# Altium schematic sheet Simon schematic_Updated_DR.SchDoc
size 594 x 420 mm; SheetNumber: 1; SheetTotal: 1
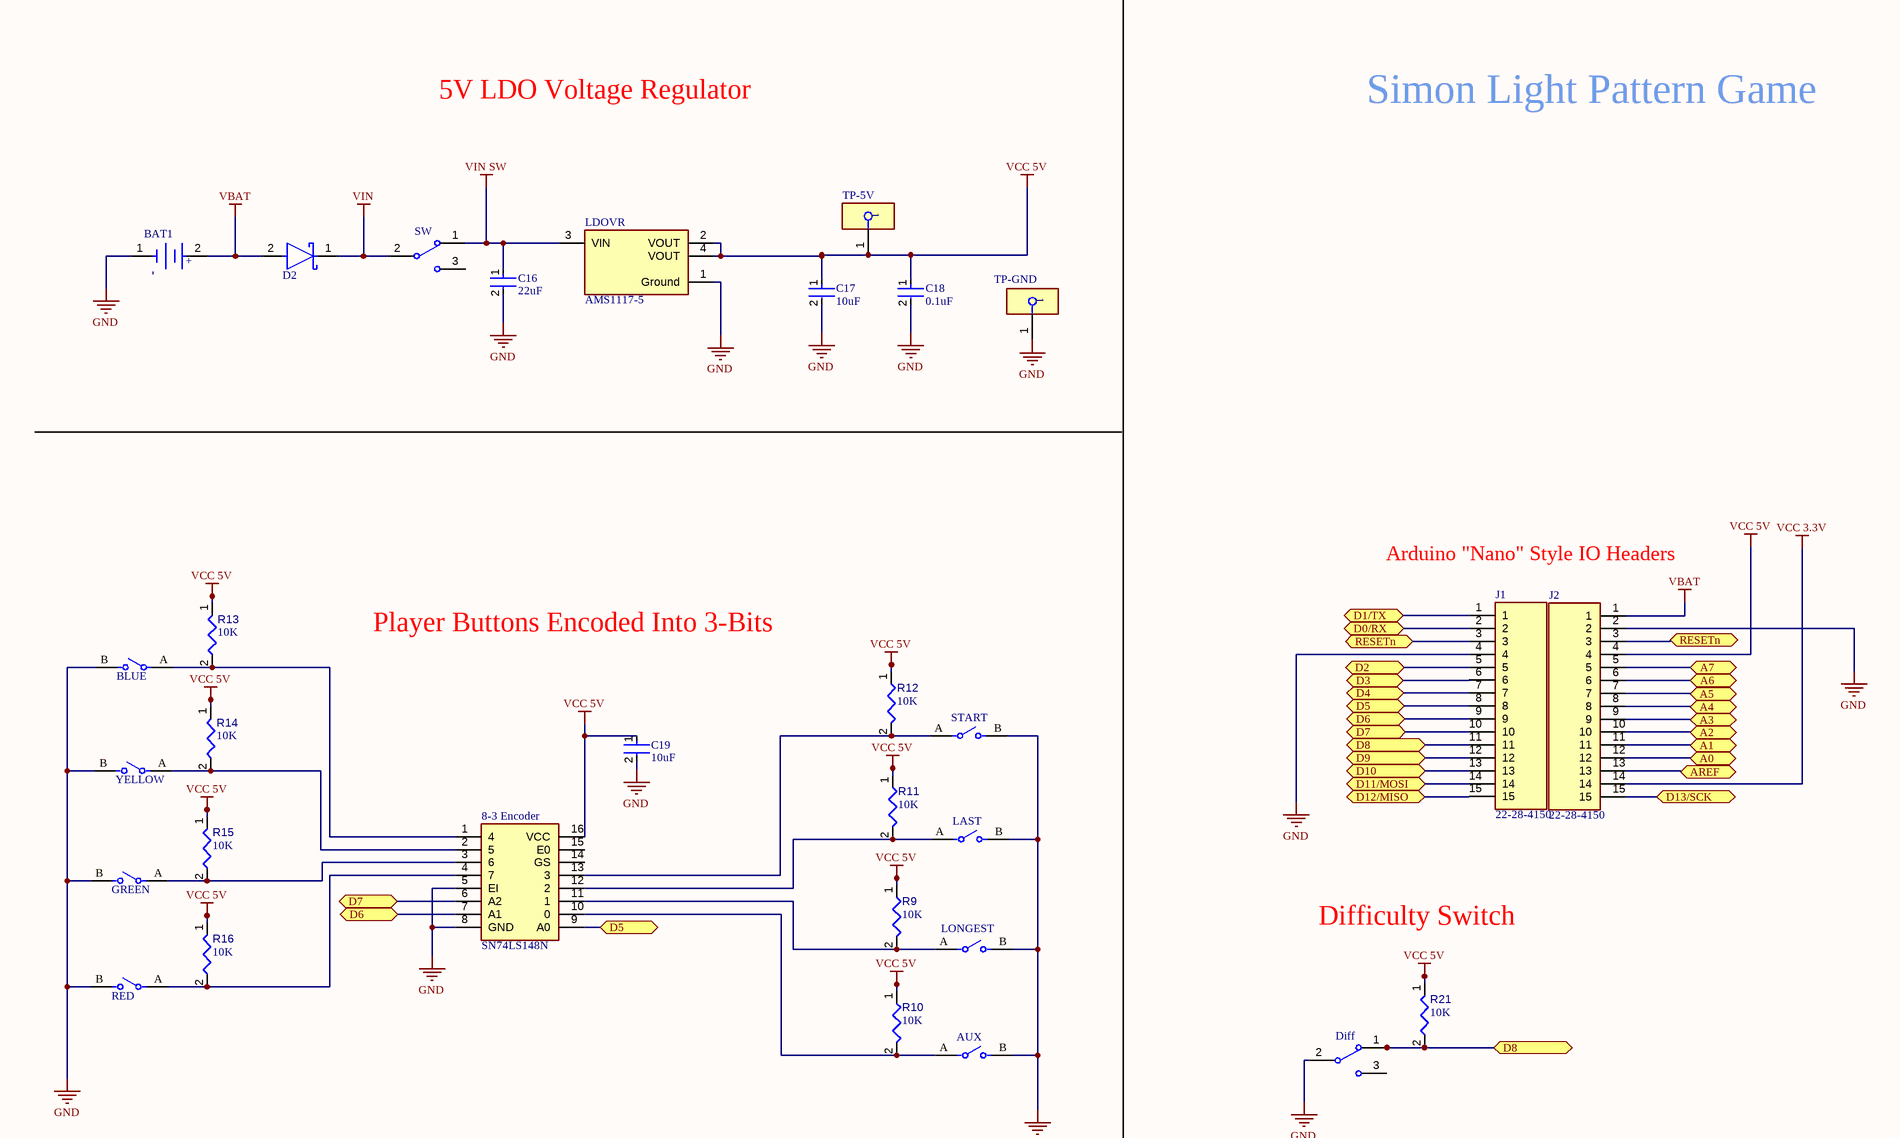
[diagram p0: Simon schematic_Updated_DR.SchDoc, top left]
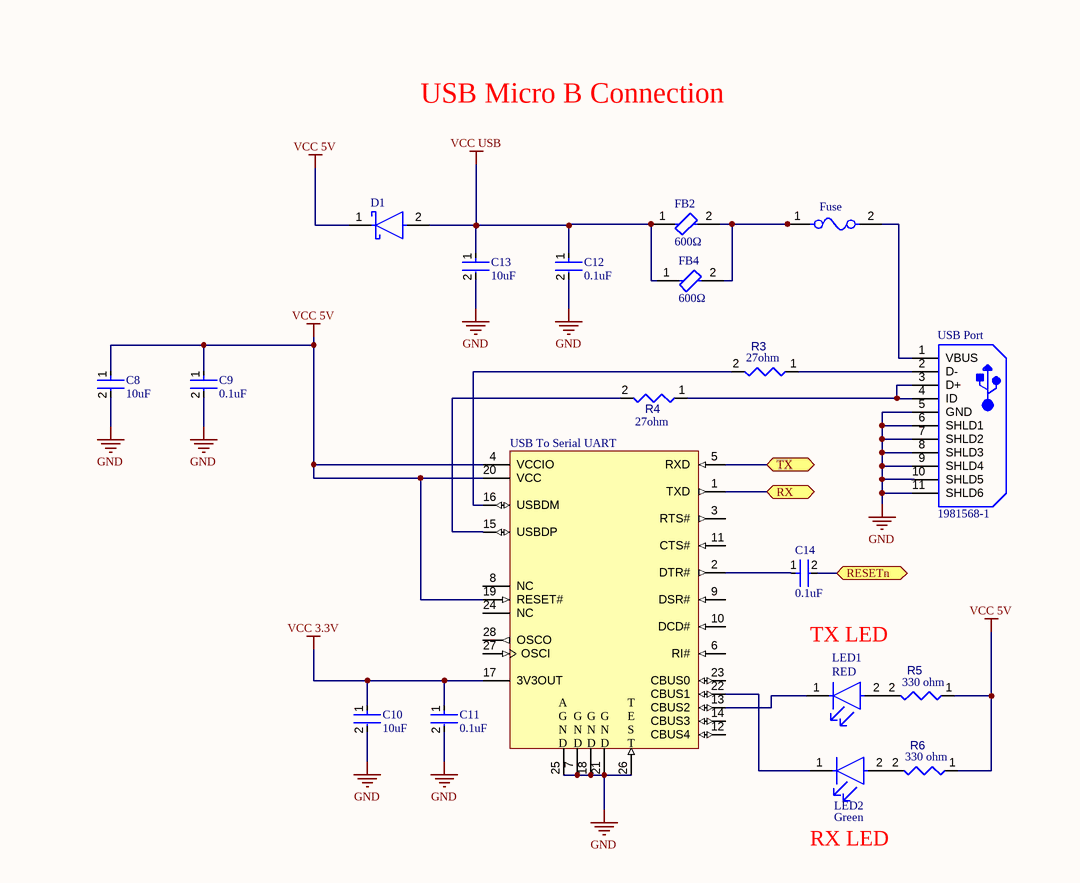
[diagram p1: Simon schematic_Updated_DR.SchDoc, top right]
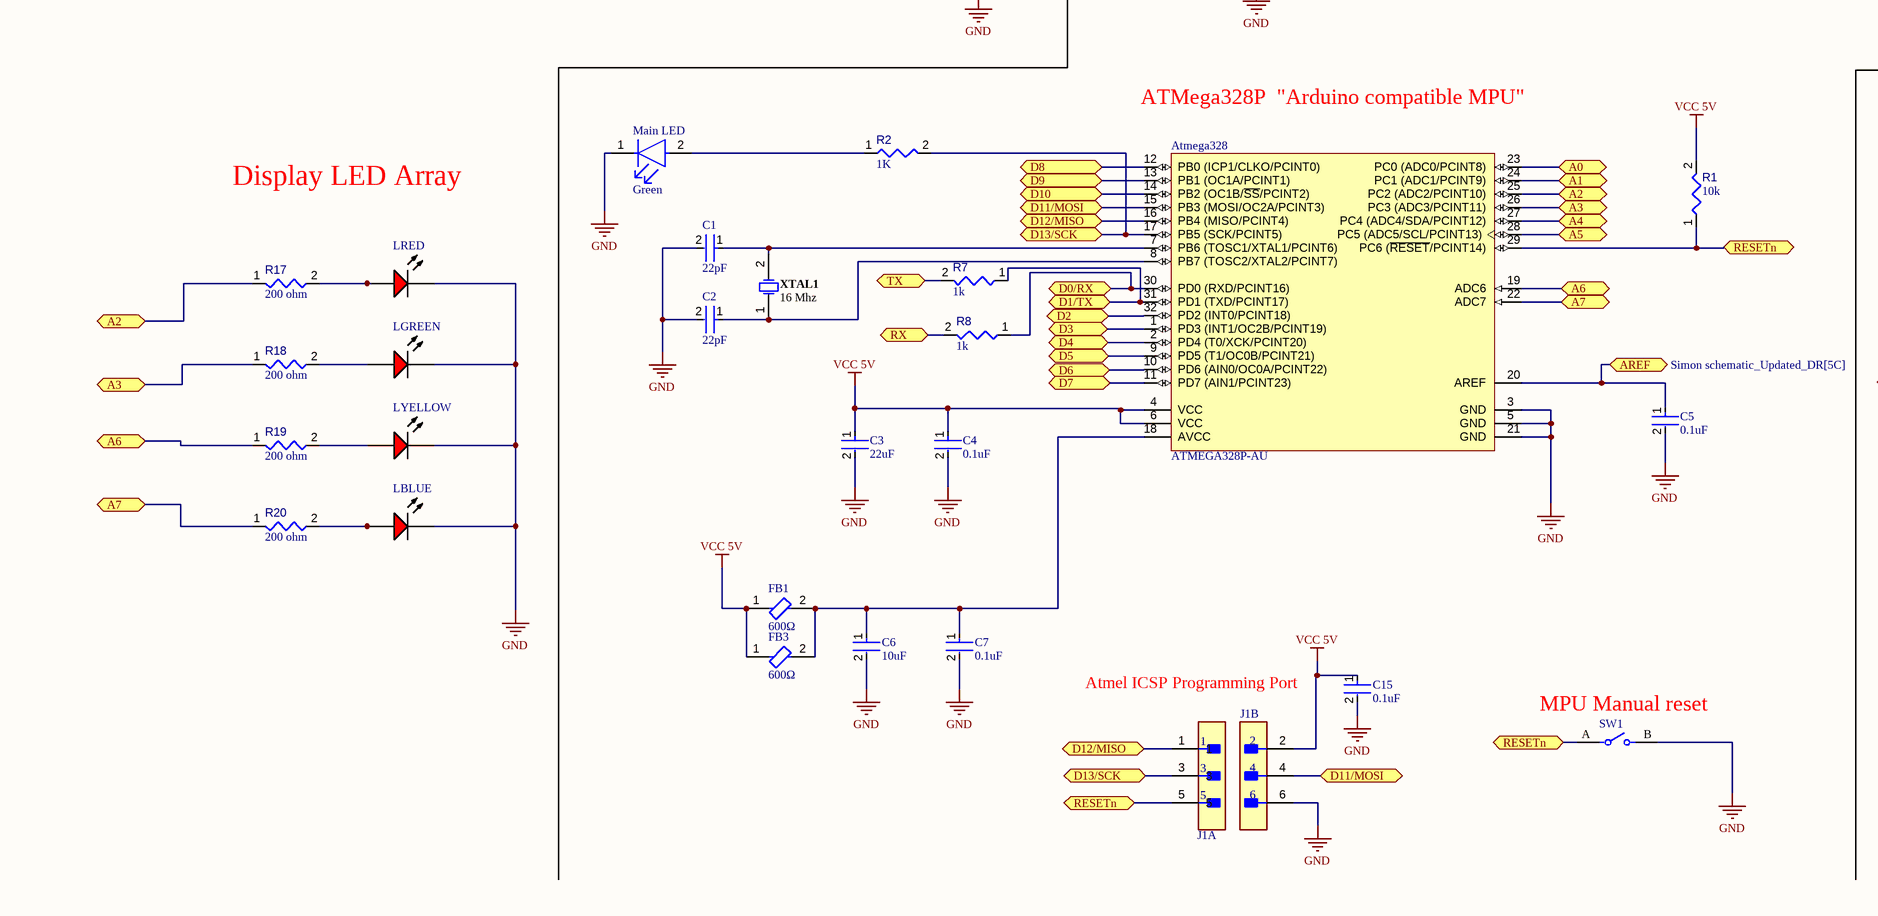
[diagram p2: Simon schematic_Updated_DR.SchDoc, bottom left]
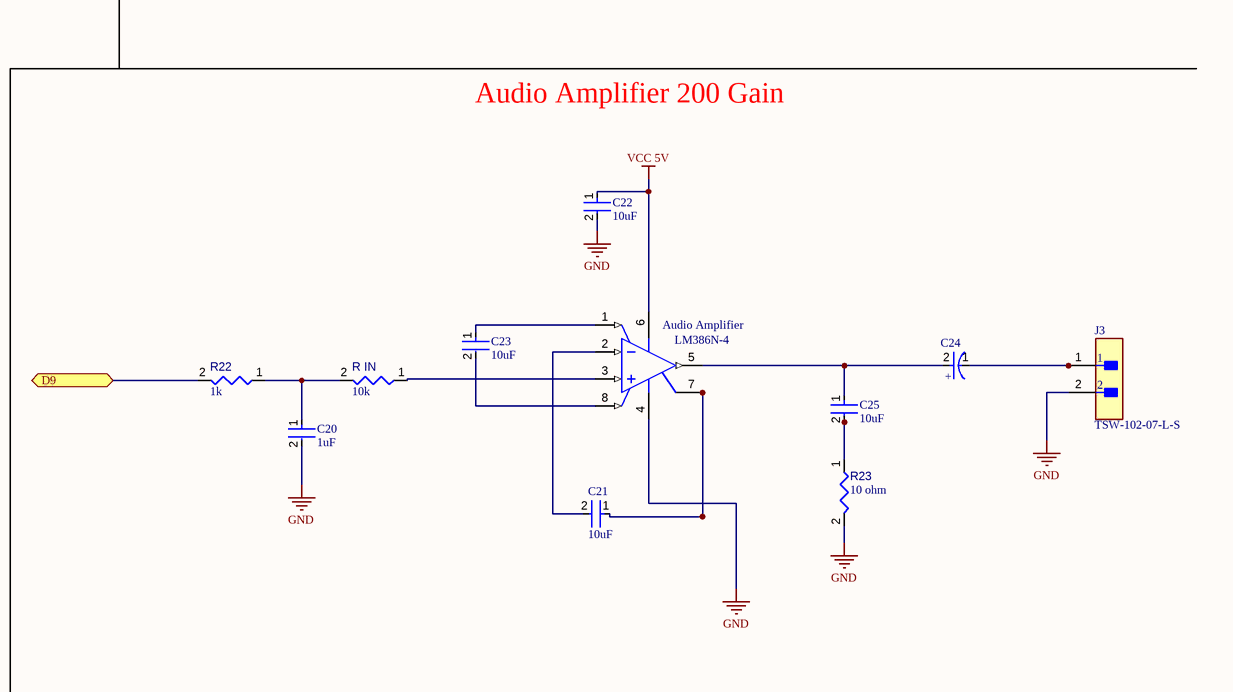
[diagram p3: Simon schematic_Updated_DR.SchDoc, bottom right]

## Parts
(Parts that share a designator on the sheet are numbered #1, #2 ... from top to bottom, then left to right.)
8-3_Encoder  SN74LS148N  [DIP794W53P254L1930H508Q16N]
Atmega328  ATMEGA328P-AU  [ATML-32A_M]
Audio_Amplifier  LM386N-4  [TI-P8]
AUX  EVQ-21405R  [FP-EVQ-21405R-MFG]  (value not drawn)
BAT1  BH9VPC  [FP-BH9VPC-MFG]  (value not drawn)
BLUE  EVQ-21405R  [FP-EVQ-21405R-MFG]  (value not drawn)
C1  22pF  [FP-0805-L_2_01_0_2-W_1_25-IPC_C]
C2  22pF  [FP-0805-L_2_01_0_2-W_1_25-IPC_C]
C3  22uF  [FP-0805-L_2_01_0_2-W_1_25-IPC_C]
C4  0.1uF  [FP-0805-L_2_01_0_2-W_1_25-IPC_C]
C5  0.1uF  [FP-0805-L_2_01_0_2-W_1_25-IPC_C]
C6  10uF  [FP-0805-L_2_01_0_2-W_1_25-IPC_C]
C7  0.1uF  [FP-0805-L_2_01_0_2-W_1_25-IPC_C]
C8  10uF  [FP-0805-L_2_01_0_2-W_1_25-IPC_C]
C9  0.1uF  [FP-0805-L_2_01_0_2-W_1_25-IPC_C]
C10  10uF  [FP-0805-L_2_01_0_2-W_1_25-IPC_C]
C11  0.1uF  [FP-0805-L_2_01_0_2-W_1_25-IPC_C]
C12  0.1uF  [FP-0805-L_2_01_0_2-W_1_25-IPC_C]
C13  10uF  [FP-0805-L_2_01_0_2-W_1_25-IPC_C]
C14  0.1uF  [FP-0805-L_2_01_0_2-W_1_25-IPC_C]
C15  0.1uF  [FP-0805-L_2_01_0_2-W_1_25-IPC_C]
C16  22uF  [FP-0805-L_2_01_0_2-W_1_25-IPC_C]
C17  10uF  [FP-0805-L_2_01_0_2-W_1_25-IPC_C]
C18  0.1uF  [FP-0805-L_2_01_0_2-W_1_25-IPC_C]
C19  10uF  [FP-0805-L_2_01_0_2-W_1_25-IPC_C]
C20  1uF  [FP-0805-L_2_01_0_2-W_1_25-IPC_C]
C21  10uF  [FP-0805-L_2_01_0_2-W_1_25-IPC_C]
C22  10uF  [FP-0805-L_2_01_0_2-W_1_25-IPC_C]
C23  10uF  [FP-0805-L_2_01_0_2-W_1_25-IPC_C]
C24  T491B106K020AT  [FP-T491B106K020AT-MFG]  (value not drawn)
C25  10uF  [FP-0805-L_2_01_0_2-W_1_25-IPC_C]
D1  SS34-E3/9AT  [FP-SMC-MFG]  (value not drawn)
D2  SS34-E3/9AT  [FP-SMC-MFG]  (value not drawn)
Diff  EG1218  [ESWI-EG1218_V]  (value not drawn)
FB1  600Ω  [FP-BLM21-0_2-t0_85-e0_5-MFG]
FB2  600Ω  [FP-BLM21-0_2-t0_85-e0_5-MFG]
FB3  600Ω  [FP-BLM21-0_2-t0_85-e0_5-MFG]
FB4  600Ω  [FP-BLM21-0_2-t0_85-e0_5-MFG]
Fuse  MF-NSMF110-2  [FP-MF-NSMF110-2-MFG]  (value not drawn)
GREEN  EVQ-21405R  [FP-EVQ-21405R-MFG]  (value not drawn)
J1#1  22-28-4150  [HDRV15W66P0X254_1X15_3810X249X838P]
J1#2  M20-9980346  [FP-M20-9980346-MFG]  (value not drawn)  (parts A,B of 2)
J2  22-28-4150  [HDRV15W66P0X254_1X15_3810X249X838P]
J3  TSW-102-07-L-S  [FP-TSW-102-07-L-S-MFG]
LAST  EVQ-21405R  [FP-EVQ-21405R-MFG]  (value not drawn)
LBLUE  C503B-RAN-CY0B0AA2  [CREE-C503B-RAN]  (value not drawn)
LDOVR  AMS1117-5  [FP-AMS1117-IPC_C]
LED1  RED  [FP-APHCM2012SYCK-F01-MFG]
LED2  Green  [FP-APHCM2012SYCK-F01-MFG]
LGREEN  C503B-RAN-CY0B0AA2  [CREE-C503B-RAN]  (value not drawn)
LONGEST  EVQ-21405R  [FP-EVQ-21405R-MFG]  (value not drawn)
LRED  C503B-RAN-CY0B0AA2  [CREE-C503B-RAN]  (value not drawn)
LYELLOW  C503B-RAN-CY0B0AA2  [CREE-C503B-RAN]  (value not drawn)
Main_LED  Green  [FP-APHCM2012SYCK-F01-MFG]
R1  10K  [RESC0805(2012)_L]
R2  1K  [RESC0805(2012)_L]
R3  27ohm  [RESC0805(2012)_L]
R4  value 27ohm  [RESC0805(2012)_L]  (hidden comment: 10K)
R5  value 330 ohm  [RESC0805(2012)_L]  (hidden comment: 330ohm)
R6  value 330 ohm  [RESC0805(2012)_L]  (hidden comment: 27ohm)
R7  1K  [RESC0805(2012)_L]
R8  value 1k  [RESC0805(2012)_L]  (hidden comment: 10K)
R9  value 10K  [RESC0805(2012)_L]  (hidden comment: 10K ohm)
R10  value 10K  [RESC0805(2012)_L]  (hidden comment: 10K ohm)
R11  value 10K  [RESC0805(2012)_L]  (hidden comment: 10K ohm)
R12  value 10K  [RESC0805(2012)_L]  (hidden comment: 10K ohm)
R13  value 10K  [RESC0805(2012)_L]  (hidden comment: 10K ohm)
R14  value 10K  [RESC0805(2012)_L]  (hidden comment: 10K ohm)
R15  value 10K  [RESC0805(2012)_L]  (hidden comment: 10K ohm)
R16  value 10K  [RESC0805(2012)_L]  (hidden comment: 10K ohm)
R17  value 200 ohm  [RESC0805(2012)_L]  (hidden comment: 10K ohm)
R18  value 200 ohm  [RESC0805(2012)_L]  (hidden comment: 10K ohm)
R19  value 200 ohm  [RESC0805(2012)_L]  (hidden comment: 10K ohm)
R20  value 200 ohm  [RESC0805(2012)_L]  (hidden comment: 10K ohm)
R21  value 10K  [RESC0805(2012)_L]  (hidden comment: 10K ohm)
R22  1K  [RESC0805(2012)_L]
R23  value 10 ohm  [RESC0805(2012)_L]  (hidden comment: 10)
R_IN  10K  [RESC0805(2012)_L]
RED  EVQ-21405R  [FP-EVQ-21405R-MFG]  (value not drawn)
START  EVQ-21405R  [FP-EVQ-21405R-MFG]  (value not drawn)
SW  EG1218  [ESWI-EG1218_V]  (value not drawn)
SW1  EVQ-21405R  [FP-EVQ-21405R-MFG]  (value not drawn)
TP-5V  S2761-46R  [FP-S2761-46R-MFG]  (value not drawn)
TP-GND  S2761-46R  [FP-S2761-46R-MFG]  (value not drawn)
USB_Port  1981568-1  [TECO-1981568-5_V]
USB_To_Serial_UART  FT232RL-REEL  [FTDI-SSOP-28_M]  (value not drawn)
XTAL1  16 Mhz  [JPY-49S-18PF]
YELLOW  EVQ-21405R  [FP-EVQ-21405R-MFG]  (value not drawn)

## Ports
A0 (bidir, see Simon schematic_Updated_DR[5C]), A0 (bidir, see Simon schematic_Updated_DR[5E]), A1 (bidir, see Simon schematic_Updated_DR[5C]), A1 (bidir, see Simon schematic_Updated_DR[5E]), A2 (bidir, see Simon schematic_Updated_DR[1E], Simon schematic_Updated_DR[5C]), A2 (bidir, see Simon schematic_Updated_DR[1E], Simon schematic_Updated_DR[5E]), A2 (bidir, see Simon schematic_Updated_DR[5C], Simon schematic_Updated_DR[5E]), A3 (bidir, see Simon schematic_Updated_DR[1E], Simon schematic_Updated_DR[5C]), A3 (bidir, see Simon schematic_Updated_DR[1E], Simon schematic_Updated_DR[5E]), A3 (bidir, see Simon schematic_Updated_DR[5C], Simon schematic_Updated_DR[5E]), A4 (bidir, see Simon schematic_Updated_DR[5C]), A4 (bidir, see Simon schematic_Updated_DR[5E]), A5 (bidir, see Simon schematic_Updated_DR[5C]), A5 (bidir, see Simon schematic_Updated_DR[5E]), A6 (bidir, see Simon schematic_Updated_DR[1E], Simon schematic_Updated_DR[5C]), A6 (bidir, see Simon schematic_Updated_DR[1E], Simon schematic_Updated_DR[5E]), A6 (bidir, see Simon schematic_Updated_DR[5C], Simon schematic_Updated_DR[5E]), A7 (bidir, see Simon schematic_Updated_DR[1E], Simon schematic_Updated_DR[5C]), A7 (bidir, see Simon schematic_Updated_DR[1E], Simon schematic_Updated_DR[5E]), A7 (bidir, see Simon schematic_Updated_DR[5C], Simon schematic_Updated_DR[5E]), AREF (bidir, see Simon schematic_Updated_DR[5C]), AREF (bidir, see Simon schematic_Updated_DR[5E]), D0/RX (bidir, see Simon schematic_Updated_DR[3E]), D0/RX (bidir, see Simon schematic_Updated_DR[4C]), D1/TX (bidir, see Simon schematic_Updated_DR[3E]), D1/TX (bidir, see Simon schematic_Updated_DR[4C]), D2 (bidir, see Simon schematic_Updated_DR[3E]), D2 (bidir, see Simon schematic_Updated_DR[4C]), D3 (bidir, see Simon schematic_Updated_DR[3E]), D3 (bidir, see Simon schematic_Updated_DR[4C]), D4 (bidir, see Simon schematic_Updated_DR[3E]), D4 (bidir, see Simon schematic_Updated_DR[4C]), D5 (bidir, see Simon schematic_Updated_DR[2D], Simon schematic_Updated_DR[3E]), D5 (bidir, see Simon schematic_Updated_DR[2D], Simon schematic_Updated_DR[4C]), D5 (bidir, see Simon schematic_Updated_DR[3E], Simon schematic_Updated_DR[4C]), D6 (bidir, see Simon schematic_Updated_DR[1C], Simon schematic_Updated_DR[3E]), D6 (bidir, see Simon schematic_Updated_DR[1C], Simon schematic_Updated_DR[4C]), D6 (bidir, see Simon schematic_Updated_DR[3E], Simon schematic_Updated_DR[4C]), D7 (bidir, see Simon schematic_Updated_DR[1C], Simon schematic_Updated_DR[3E]), D7 (bidir, see Simon schematic_Updated_DR[1C], Simon schematic_Updated_DR[4C]), D7 (bidir, see Simon schematic_Updated_DR[3E], Simon schematic_Updated_DR[4C]), D8 (bidir, see Simon schematic_Updated_DR[3E], Simon schematic_Updated_DR[4C]), D8 (bidir, see Simon schematic_Updated_DR[3E], Simon schematic_Updated_DR[4D]), D8 (bidir, see Simon schematic_Updated_DR[4C], Simon schematic_Updated_DR[4D]), D9 (bidir, see Simon schematic_Updated_DR[3E], Simon schematic_Updated_DR[4C]), D9 (bidir, see Simon schematic_Updated_DR[3E], Simon schematic_Updated_DR[5E]), D9 (bidir, see Simon schematic_Updated_DR[4C], Simon schematic_Updated_DR[5E]), D10 (bidir, see Simon schematic_Updated_DR[3E]), D10 (bidir, see Simon schematic_Updated_DR[4C]), D11/MOSI (bidir, see Simon schematic_Updated_DR[3E], Simon schematic_Updated_DR[4C]), D11/MOSI (bidir, see Simon schematic_Updated_DR[3E], Simon schematic_Updated_DR[4F]), D11/MOSI (bidir, see Simon schematic_Updated_DR[4C], Simon schematic_Updated_DR[4F]), D12/MISO (bidir, see Simon schematic_Updated_DR[3E], Simon schematic_Updated_DR[3F]), D12/MISO (bidir, see Simon schematic_Updated_DR[3E], Simon schematic_Updated_DR[4C]), D12/MISO (bidir, see Simon schematic_Updated_DR[3F], Simon schematic_Updated_DR[4C]), D13/SCK (bidir, see Simon schematic_Updated_DR[3E], Simon schematic_Updated_DR[3F]), D13/SCK (bidir, see Simon schematic_Updated_DR[3E], Simon schematic_Updated_DR[5C]), D13/SCK (bidir, see Simon schematic_Updated_DR[3F], Simon schematic_Updated_DR[5C]), RESETn (bidir, see Simon schematic_Updated_DR[3F], Simon schematic_Updated_DR[4C], Simon schematic_Updated_DR[5C], Simon schematic_Updated_DR[5E], Simon schematic_Updated_DR[5F]), RESETn (bidir, see Simon schematic_Updated_DR[3F], Simon schematic_Updated_DR[4C], Simon schematic_Updated_DR[5C], Simon schematic_Updated_DR[5E], Simon schematic_Updated_DR[8C]), RESETn (bidir, see Simon schematic_Updated_DR[3F], Simon schematic_Updated_DR[4C], Simon schematic_Updated_DR[5C], Simon schematic_Updated_DR[5F], Simon schematic_Updated_DR[8C]), RESETn (bidir, see Simon schematic_Updated_DR[3F], Simon schematic_Updated_DR[4C], Simon schematic_Updated_DR[5E], Simon schematic_Updated_DR[5F], Simon schematic_Updated_DR[8C]), RESETn (bidir, see Simon schematic_Updated_DR[3F], Simon schematic_Updated_DR[5C], Simon schematic_Updated_DR[5E], Simon schematic_Updated_DR[5F], Simon schematic_Updated_DR[8C]), RESETn (bidir, see Simon schematic_Updated_DR[4C], Simon schematic_Updated_DR[5C], Simon schematic_Updated_DR[5E], Simon schematic_Updated_DR[5F], Simon schematic_Updated_DR[8C]), RX (bidir, see Simon schematic_Updated_DR[3E]), RX (bidir, see Simon schematic_Updated_DR[8C]), TX (bidir, see Simon schematic_Updated_DR[3E]), TX (bidir, see Simon schematic_Updated_DR[8C])

## Nets
GND: 8-3_Encoder.5(EI) 8-3_Encoder.8(GND) Atmega328.3(GND) Atmega328.5(GND) Atmega328.21(GND) Audio_Amplifier.4(GND) AUX.B BAT1.1(C) BLUE.B C1.2 C2.2 C3.2 C4.2 C5.2 C6.2 C7.2 C8.2 C9.2 C10.2 C11.2 C12.2 C13.2 C15.2 C16.2 C17.2 C18.2 C19.2 C20.2 C22.2 Diff.2(COM) GREEN.B J1#1.4 J1#2.6 J2.2 J3.2 LAST.B LBLUE.2(K) LDOVR.1(Ground) LGREEN.2(K) LONGEST.B LRED.2(K) LYELLOW.2(K) Main_LED.1(C) R23.2 RED.B START.B SW1.B TP-GND.1 USB_Port.5(GND) USB_Port.6(SHLD1) USB_Port.7(SHLD2) USB_Port.8(SHLD3) USB_Port.9(SHLD4) USB_Port.10(SHLD5) USB_Port.11(SHLD6) USB_To_Serial_UART.7(GND) USB_To_Serial_UART.18(GND) USB_To_Serial_UART.21(GND) USB_To_Serial_UART.25(AGND) USB_To_Serial_UART.26(TEST) YELLOW.B
VBAT: BAT1.2(A) D2.2(A) J2.1
VCC 3.3V: C10.1 C11.1 J2.14 USB_To_Serial_UART.17(3V3OUT)
VCC 5V: 8-3_Encoder.16(VCC) Atmega328.4(VCC) Atmega328.6(VCC) Audio_Amplifier.6(VS) C3.1 C4.1 C8.1 C9.1 C15.1 C17.1 C18.1 C19.1 C22.1 D1.1(C) FB1.1 FB3.1 J1#2.2 J2.4 LDOVR.2(VOUT) LDOVR.4(VOUT) R1.2 R5.1 R6.1 R9.1 R10.1 R11.1 R12.1 R13.1 R14.1 R15.1 R16.1 R21.1 TP-5V.1 USB_To_Serial_UART.4(VCCIO) USB_To_Serial_UART.19(RESET#) USB_To_Serial_UART.20(VCC)
VCC USB: C12.1 C13.1 D1.2(A) FB2.1 FB4.1
VIN: D2.1(C) SW.2(COM)
VIN SW: C16.1 LDOVR.3(VIN) SW.1
A0: Atmega328.23(PC0_(ADC0/PCINT8)) J2.12 ; port A0
A1: Atmega328.24(PC1_(ADC1/PCINT9)) J2.11 ; port A1
A2: Atmega328.25(PC2_(ADC2/PCINT10)) J2.10 R17.1 ; port A2
A3: Atmega328.26(PC3_(ADC3/PCINT11)) J2.9 R18.1 ; port A3
A4: Atmega328.27(PC4_(ADC4/SDA/PCINT12)) J2.8 ; port A4
A5: Atmega328.28(PC5_(ADC5/SCL/PCINT13)) J2.7 ; port A5
A6: Atmega328.19(ADC6) J2.6 R19.1 ; port A6
A7: Atmega328.22(ADC7) J2.5 R20.1 ; port A7
AREF: Atmega328.20(AREF) C5.1 J2.13 ; port AREF
D0/RX: Atmega328.30(PD0_(RXD/PCINT16)) J1#1.2 R8.1 ; port D0/RX
D1/TX: Atmega328.31(PD1_(TXD/PCINT17)) J1#1.1 R7.1 ; port D1/TX
D2: Atmega328.32(PD2_(INT0/PCINT18)) J1#1.5 ; port D2
D3: Atmega328.1(PD3_(INT1/OC2B/PCINT19)) J1#1.6 ; port D3
D4: Atmega328.2(PD4_(T0/XCK/PCINT20)) J1#1.7 ; port D4
D5: 8-3_Encoder.9(A0) Atmega328.9(PD5_(T1/OC0B/PCINT21)) J1#1.8 ; port D5
D6: 8-3_Encoder.7(A1) Atmega328.10(PD6_(AIN0/OC0A/PCINT22)) J1#1.9 ; port D6
D7: 8-3_Encoder.6(A2) Atmega328.11(PD7_(AIN1/PCINT23)) J1#1.10 ; port D7
D8: Atmega328.12(PB0_(ICP1/CLKO/PCINT0)) Diff.1 J1#1.11 R21.2 ; port D8
D9: Atmega328.13(PB1_(OC1A/PCINT1)) J1#1.12 R22.2 ; port D9
D10: Atmega328.14(PB2_(OC1B/~{SS}/PCINT2)) J1#1.13 ; port D10
D11/MOSI: Atmega328.15(PB3_(MOSI/OC2A/PCINT3)) J1#1.14 J1#2.4 ; port D11/MOSI
D12/MISO: Atmega328.16(PB4_(MISO/PCINT4)) J1#1.15 J1#2.1 ; port D12/MISO
D13/SCK: Atmega328.17(PB5_(SCK/PCINT5)) J1#2.3 J2.15 R2.2 ; port D13/SCK
RESETn: Atmega328.29(PC6_(~{RESET}/PCINT14)) C14.2 J1#1.3 J1#2.5 J2.3 R1.1 SW1.A ; port RESETn
RX: R8.2 USB_To_Serial_UART.1(TXD) ; port RX
TX: R7.2 USB_To_Serial_UART.5(RXD) ; port TX
Net8-3_Encoder_1: 8-3_Encoder.1(4) BLUE.A R13.2
Net8-3_Encoder_2: 8-3_Encoder.2(5) R14.2 YELLOW.A
Net8-3_Encoder_3: 8-3_Encoder.3(6) GREEN.A R15.2
Net8-3_Encoder_4: 8-3_Encoder.4(7) R16.2 RED.A
Net8-3_Encoder_10: 8-3_Encoder.10(0) AUX.A R10.2
Net8-3_Encoder_11: 8-3_Encoder.11(1) LONGEST.A R9.2
Net8-3_Encoder_12: 8-3_Encoder.12(2) LAST.A R11.2
Net8-3_Encoder_13: 8-3_Encoder.13(3) R12.2 START.A
NetAtmega328_7: Atmega328.7(PB6_(TOSC1/XTAL1/PCINT6)) C1.1 XTAL1.2
NetAtmega328_8: Atmega328.8(PB7_(TOSC2/XTAL2/PCINT7)) C2.1 XTAL1.1
NetAtmega328_18: Atmega328.18(AVCC) C6.1 C7.1 FB1.2 FB3.2
NetAudio_Amplifier_1: Audio_Amplifier.1(GAIN) C23.1
NetAudio_Amplifier_2: Audio_Amplifier.2(IN-) C21.2
NetAudio_Amplifier_3: Audio_Amplifier.3(IN+) R_IN.1
NetAudio_Amplifier_5: Audio_Amplifier.5(VOUT) C24.2(A) C25.1
NetAudio_Amplifier_7: Audio_Amplifier.7(BYPASS) C21.1
NetAudio_Amplifier_8: Audio_Amplifier.8(GAIN) C23.2
NetC14_1: C14.1 USB_To_Serial_UART.2(DTR#)
NetC20_1: C20.1 R22.1 R_IN.2
NetC24_1: C24.1(C) J3.1
NetC25_2: C25.2 R23.1
NetFB2_2: FB2.2 FB4.2 Fuse.1
NetFuse_2: Fuse.2 USB_Port.1(VBUS)
NetLBLUE_1: LBLUE.1(A) R20.2
NetLED1_1: LED1.1(C) USB_To_Serial_UART.13(CBUS2)
NetLED1_2: LED1.2(A) R5.2
NetLED2_1: LED2.1(C) USB_To_Serial_UART.22(CBUS1)
NetLED2_2: LED2.2(A) R6.2
NetLGREEN_1: LGREEN.1(A) R18.2
NetLRED_1: LRED.1(A) R17.2
NetLYELLOW_1: LYELLOW.1(A) R19.2
NetMain_LED_2: Main_LED.2(A) R2.1
NetR3_1: R3.1 USB_Port.2(D-)
NetR3_2: R3.2 USB_To_Serial_UART.16(USBDM)
NetR4_1: R4.1 USB_Port.3(D+) USB_Port.4(ID)
NetR4_2: R4.2 USB_To_Serial_UART.15(USBDP)

Not connected (* = marked no-connect by the designer): 8-3_Encoder 14(GS) 15(E0); Diff 3; SW 3; USB_To_Serial_UART 3(RTS#) 6(RI#) 8(NC) 9(DSR#) 10(DCD#) 11(CTS#) 12(CBUS4) 14(CBUS3) 23(CBUS0) 24(NC) 27(OSCI) 28(OSCO)

## Notes on the sheet
- 5V LDO Voltage Regulator
- Simon Light Pattern Game
- USB Micro B Connection
- Arduino "Nano" Style IO Headers
- Player Buttons Encoded Into 3-Bits
- TX LED
- Difficulty Switch
- RX LED
- ATMega328P  "Arduino compatible MPU"
- Audio Amplifier 200 Gain
- Display LED Array
- Atmel ICSP Programming Port
- (near SW1) MPU Manual reset
- DWG NO:
- REV:
- THIS DOCUMENT AND THE DATA DISCLOSED HEREIN OR
- HEREWITH IS THE PROPERTY OF ALTIUM LIMITED AND MAY
- BE FREELY DISTRIBUTED IN WHOLE. NO RIGHTS ARE
- RESERVED OR EXPRESS OR IMPLIED WARANTEE GIVEN.
- REVISION
- DESCRIPTION
- DATE
- APPROVED
- ENG:
- APPROVALS
- PROJECT
- DSN:
- CHK:
- REFERENCE DOCUMENTS
- PROJECT REVISION:
- TITLE
- DOCUMENT REVISION:
- DESIGN ITEM:
- BOM:
- FAB DWG:
- PCB DWG:
- ASSY DWG:
- SCALE:
- A2
- SIZE
- CAGE CODE
- FILE NAME
- DWG NO.
- SHEET
- OF
- REV
- (in symbol CMP-015-00000-2) A / G / N / D; G / N / D; T / E / S / T
- (in symbol CMP-2000-07191-2) +
- (in symbol CMP-136216-000001-1) +; -

## Library data of the parts
8-3_Encoder = SN74LS148N: 8-Line to 3-Line Priority Encoder; Manufacturer_Name: Texas Instruments; Geometry.Height: 5.08mm; Manufacturer_Part_Number: SN74LS148N; Mouser Part Number: 595-SN74LS148N; Mouser Price/Stock: https://www.mouser.co.uk/ProductDetail/Texas-Instruments/SN74LS148N?qs=dQtLEVC3WoZem4LPSmNMPw%3D%3D; Arrow Part Number: SN74LS148N; Arrow Price/Stock: https://www.arrow.com/en/products/sn74ls148n/texas-instruments?region=nac; Datasheet Link: https://datasheet.datasheetarchive.com/originals/distributors/Datasheets-SFU2/DSASFU100029941.pdf
Atmega328 = CMP-020-00003-3: 8-Bit Microcontroller with 32 KBytes In-System Programmable Flash, 23 I/Os, -40 to 85 degC, 32-Pin TQFP (32A), RoHS, Tray; Manufacturer: Atmel; PWM Channels: 6; Frequency: 20MHz; RAM Size: 2KB; ADC Channels: 8; Max Supply Voltage: 5.5V; Density: 32KB; USB Channels: 0; I/Os: 23; Min Supply Voltage: 1.8V; Interface: USART; Package Reference: 32A; Package Description: 32-Pin Thin Profile Plastic Quad Flat Package, Body 7 x 7 mm, Pitch 0.8 mm; Max Operating Temperature: 85°C; Mounting Technology: SM; Datasheet URL: http://www.atmel.com/images/Atmel-8271-8-bit-AVR-Microcontroller-ATmega48A-48PA-88A-88PA-168A-168PA-328-328P_datasheet_Complete.pdf; Pins: 32; Packaging: Tray; RoHS Compliant: True; Max Clock Frequency: 20MHz; Ethernet Channels: 0; Clock Frequency: 20MHz; Case/Package: TQFP; Manufacturer URL: http://www.atmel.com/; Datasheet Version: Rev. 8271J, 11/2015; Package Quantity: 250; Min Operating Temperature: -40°C
Audio_Amplifier = CMP-0057-00050-3: Low Voltage Audio Power Amplifier, 0 to 70 degC, 8-pin DIP (P8); Manufacturer: Texas Instruments; SubFamily: Mid/High-Power Amplifier; Input Type: Analog; Max. Number of Speaker Outputs: 1; Mounting Technology: Through Hole; PartNumber: LM386N-4; PackageDescription: 8-Pin Plastic In-Line, Body 9.59 x 6.35 mm, Pitch 2.54 mm; ComponentLink1Description: Manufacturer URL; ComponentLink2Description: Datasheet; ComponentLink3Description: Package Specification; PackageVersion: 4040082/E, 04/2010; ComponentLink1URL: http://www.ti.com/; DatasheetVersion: SNAS545A; Code_JEDEC: MS-001; ComponentLink2URL: http://www.ti.com/general/docs/lit/getliterature.tsp?genericPartNumber=LM386&fileType=pdf; PackageReference: P8; ComponentLink3URL: http://www.ti.com/litv/pdf/mpdi001b
AUX BLUE GREEN LAST LONGEST RED START SW1 YELLOW = CMP-00287-55650591-1: EVQ-21405R Switch Tactile N.O. SPST Round Button PC Pins 0.02A 15VDC 1.3N Thru-Hole Radial T/R; Contact Current Rating: 20mA; Voltage Rating (DC): 15V; Actuator Length: 1.6mm; Life (Cycles): 100kcycles; Switch Travel: 250µm; Number of Positions: 2; Contact Resistance: 50mΩ; Illumination Type: Illuminated, Non-Illuminated; Switch Function: Off-Mom; Operating Force: 1.3N; Lead Free: Lead Free; Current Rating: 20mA; NexarPartId: 55650591; Min Operating Temperature: -20°C; Depth: 6mm; Width: 6mm; Radiation Hardening: No; Orientation: Straight; Throw Configuration: SPST; Case/Package: Radial; Termination: PC Pin; Max Current Rating: 20mA; Max Voltage Rating (DC): 15V; Electrical Life: 100kcycles; Contact Plating: Silver; REACH SVHC: Unknown; Max Operating Temperature: 70°C; Weight: 1.451496g; Mount: Through Hole; RoHS: Compliant; Mechanical Life: 100kcycles; Height: 5mm; Length: 6mm
BAT1 = CMP-136216-000001-1: BATTERY HOLDER 9V PC PIN; Manufacturer: Memory Protection Devices; Conn Orientation: Vertical; Is Female: yes; Number Of Contacts: 2; Device Class L2: unset; Contact Material: Nickel; Device Class L1: Connectors; Lead Free: Yes; Digikey Description: BATTERY HOLDER 9V PC PIN; Category: Batt; ComponentLink2URL: http://www.memoryprotectiondevices.com/datasheets/BH9VPC-datasheet.pdf; Device Class L3: unset; Package: 0; Automotive: No; ComponentLink2Description: Datasheet; Height: 21.12mm; Voltage Rating: 9V; Octopart: https://octopart.com/bh9vpc-memory+protection+devices-22788154; RoHS: TRUE; Manufacturer Part Number: BH9VPC
C1-C23 C25 = CMP-2000-05016-2: General Purpose Ceramic Capacitor, 0805, 100nF, 10%, X7R, 0.15, 50V; Dissipation Factor: 2.5%; Insulation Resistance: 100GR; Voltage Rating (DC): 50V; Package Quantity: 4000; Tolerance: 10%; Voltage Rating: 50V; Dielectric: X7R; Case/Package: 0805; Lead Free: Lead Free; Dielectric Material: Ceramic; Thickness: 0.037inch; Weight: 0.001411oz; Max Operating Temperature: 125°C; REACH SVHC: No SVHC; Mount: Surface Mount; RoHS Compliant: Yes; Depth: 1.25mm; Height: 0.5mm; Case Code (Metric): 2012; Length: 2mm; Termination: Standard; Case Code (Imperial): 0805; Number of Pins: 2; Voltage: 50V; Radiation Hardening: No; Min Operating Temperature: -55°C; Capacitance: 100nF; Width: 1.2mm; Series: MLCC X7R; Packaging: Cut Tape
C24 = CMP-2000-07191-2: CAP TANT 10UF 10% 20V 1411; Polarity: Polar; Life (Hours): 2000Hour; Dissipation Factor: 6%; Leakage Current: 2uA; Dielectric Material: Tantalum; Ripple Current: 201mA; ESR (Equivalent Series Resistance): 2.1R; Weight: 0.002293oz; Max Operating Temperature: 125°C; Failure Rate: 0.001%; Tolerance: 10%; Case Code (Metric): 3528; Case Code (Imperial): 1411; Number of Pins: 2; Case/Package: 1411; Width: 2.8mm; Height: 1.9mm; Voltage Rating: 20V; Voltage: 20V; Lead Free: Lead Free; Features: General Purpose; Radiation Hardening: No; Min Operating Temperature: -55°C; Length: 3.5mm; Mount: Surface Mount; Depth: 2.8mm; Voltage Rating (DC): 20V; Termination: SMD/SMT; Package Quantity: 1; Capacitance: 10uF; Packaging: Tape and Reel; RoHS Compliant: Yes; REACH SVHC: No SVHC; Height - Seated (Max): 0.083inch
D1 D2 = CMP-02539-000066-1: DIODE SCHOTTKY 40V 3A DO214AB; Peak Non-Repetitive Surge Current: 100A; Forward Voltage: 500mV; Element Configuration: Single; Max Reverse Current: 500uA; Case/Package: SMC; Radiation Hardening: No; Series: -; Max Surge Current: 100A; RoHS Compliant: Yes; Min Operating Temperature: -55°C; Average Rectified Current: 3A; Max Reverse Leakage Current: 500uA; Package Quantity: 3500; Max Reverse Voltage (DC): 40V; Forward Current: 3A; Packaging: Tape and Reel; Max Operating Temperature: 125°C; Max Repetitive Reverse Voltage (Vrrm): 40V; Number of Pins: 2; Mount: Surface Mount
Diff SW = CMP-011-00006-2: Slide Switch, SPDT, 500 V, -20 to 70 degC, 3-Pin THD, RoHS, Bulk; Manufacturer: E-Switch; Voltage Rating (DC): 30V; Current Rating: 200mA; Operating Force: 250gf; Package Quantity: 1000; Contact Plating: Silver; Max Operating Temperature: 70°C; Min Operating Temperature: -20°C; Contact Material: Copper; Datasheet URL: https://www.e-switch.com/system/asset/product_line/data_sheet/119/EG.pdf; Contact Finish: Silver; Case/Package: EG1218; Voltage Rating (AC): 30V; Datasheet Version: Oct-15; Package Description: 3-Pin Through Hole Device, Body 11.6 x 4 mm, Pitch 2.5 mm; RoHS Compliant: True; Package Reference: EG1218; Manufacturer URL: http://www.e-switch.ch/en/; Throw Configuration: SPDT; Contact Current Rating: 200mA; Mounting Technology: TH; Packaging: Bulk; Pins: 3
FB1-FB4 = CMP-0686-00665-3: Chip Ferrite Bead, 0805, 1000Ω @ 100MHz, 0.27Ω, 25%, 600mA; Material: Steel; Number of Lines: 1; Current Rating: 500mA; Max DC Current: 200mA; Impedance: 1kR; DC Resistance (DCR): 280mR; Shielding: Unshielded; Length: 2mm; Max Current Rating: 600mA; Max Operating Temperature: 125°C; Lead Free: Lead Free; Test Frequency: 100MHz; Number of Pins: 2; Height: 0.85mm; Package Quantity: 1; Termination: SMD/SMT; Depth: 1.25mm; Radiation Hardening: No; Case Code (Metric): 2012; Tolerance: 25%; Core Material: Ferrite; Min Operating Temperature: -55°C; Case Code (Imperial): 0805; Weight: 0.000194oz; DC Current: 200mA; Case/Package: 0805; REACH SVHC: No SVHC; Frequency: 100MHz; Military Standard: Not; Number of Circuits: 1; Width: 1.25mm; Packaging: Tape and Reel
Fuse = CMP-07400-000012-1: PTC RESET FUSE 6V 1.1A 1206; Manufacturer: Bourns; Trip Current: 2.2A; Current Rating: 100A; Trip Time: 0.1s; Resistance: 0.06-0.2Ω; Value: 0.06-0.2Ω; Automotive Grade: Grade 3; Category: Fuse; Digikey Description: PTC RESET FUSE 6V 1.1A 1206; RoHS: TRUE; Temperature: -40°C to +85°C; Lead Free: Yes; Temperature Range High: +85°C; Ambient Temperature Range Low: -40°C; Mouser Description: Resettable Fuses - PPTC 1.1A 6V 0.06ohm; Hold Current: 1.1A; ComponentLink2URL: https://www.bourns.com/docs/Product-Datasheets/mfnsmf.pdf; Height: 0.7mm; Device Class L2: PTC Resettable Fuses; ComponentLink2Description: Datasheet; Automotive: Yes; Ambient Temperature Range High: +85°C; Temperature Range Low: -40°C; Device Class L1: Circuit Protection; Octopart: https://octopart.com/mf-nsmf110-2-bourns-41795; Voltage Rating: 6V; Package: MF-NSMF110-2; Manufacturer Part Number: MF-NSMF110-2; Device Class L3: unset
J1#1 J2 = 22-28-4150: Headers & Wire Housings 15P VERT HEADER Sn; Manufacturer_Name: Molex; Geometry.Height: 8.38mm; Mouser Part Number: 538-22-28-4150; Mouser Price/Stock: https://www.mouser.co.uk/ProductDetail/Molex/22-28-4150?qs=M5Ic86%252BuP8aClMFgmZrq7g%3D%3D; Manufacturer_Part_Number: 22-28-4150; Datasheet Link: https://componentsearchengine.com/Datasheets/1/22-28-4150.pdf
J1#2 = CMP-2000-06636-2: CONN HEADER VERT 6POS 2.54MM; Manufacturer: Harwin; Current Rating: 3A; Number Of Contacts: 6; Conn Gender: Male; Conn Orientation: Vertical; Device Class L1: Connectors; ComponentLink2Description: Datasheet; Height: 8.99mm; Temperature Range High: +105°C; Contact Material: Tin,Nickel; RoHS: TRUE; Temperature Range Low: -40°C; ComponentLink2URL: https://cdn.harwin.com/pdfs/M20-998.pdf; Digikey Description: CONN HEADER VERT 6POS 2.54MM; Pitch: 2.54mm; Package: M20-9980346; Device Class L2: Headers and Wire Housings; Manufacturer Part Number: M20-9980346; Number Of Rows: 2; Category: Conn; Lead Free: Yes; Mouser Description: 2.54mm (0.1") Pitch DIL Vertical PC Tail Pin Header, 6.1mm mating pin height, tin, 3+3 contacts; Temperature: -40°C to +105°C; Device Class L3: unset; Octopart: https://octopart.com/m20-9980346-harwin-5436545; Automotive: No
J3 = CMP-02766-001428-1: CONN HEADER VERT 2POS 2.54MM; Voltage Rating: 550V; Current Rating: 7.6A; Gender: Male; Number of Contacts: 2; Connector Type: Male Pin; Radiation Hardening: No; Orientation: Straight; Contact Plating: Gold; Max Operating Temperature: 125°C; Mount: Through Hole; Package Quantity: 1; Number of Rows: 1; Housing Material: Polyester; RoHS Compliant: Yes; Length: 5.08mm; Max Voltage Rating (AC): 550V; Pitch: 2.54mm; Packaging: Bulk; Depth: 2.54mm; Termination: Solder; Min Operating Temperature: -55°C; Housing Color: Black; Lead Free: Lead Free; Color: Black; Number of Positions: 2; Width: 2.54mm; Max Current Rating: 7.6A; REACH SVHC: No SVHC; Contact Material: Bronze; Contact Mating Length: 0.23inch; Series: TSW; Contact Type: Male Pin
LBLUE LGREEN LRED LYELLOW = CMP-2000-06058-1: Cree(R) 5-mm Red Round LED, 2.1 V, -40 to 100 degC, 2-Pin THD, RoHS, Ammo; Forward Current: 50mA; Product Depth (mm): 5.8mm; Power Dissipation: 130mW; Viewing Angle: 15°; Test Current (It): 20mA; Shape Type: Circular; Product Height (mm): 8.8mm; Luminous Intensity: 12000mcd; Main Category: StandardLED; Forward Voltage: 2.6V; Number of  Elements: 1; Dominant Wave Length: 624nm; Reverse Voltage: 5V; Mounting Technology: ThroughHole; Datasheet Version: 12/2014; Manufacturer URL: http://www.cree.com/; Packaging: AmmoPack; Operating Temperature Classification: Industrial; Package Description: 2-Pin Through Hole Device, Dia 5.8 mm, Pitch 2.54 mm; Package Reference: C503B-RAN; Type: Uni-Color; Product Length (mm): 5.8mm; Datasheet URL: http://www.cree.com/sitecore-modules/web/~/media/Files/Cree/LED-Components-and-Modules/HB/Data-Sheets/C503B-RAS-RAN-AAS-AAN-RBS-RBN-ABS-ABN-RCS-RCN-ACS-ACN-1079.pdf; Operating Temp Range: -40Cto100C; Manufacturer: Cree; Mounting: ThroughHole; Emitting Color: Red; Lens Dimensions: 5x5x7.8mm; Package Type: T-13/4; Pin Count: 2
LDOVR = CMP-209535-000001-1: LDO Voltage Regulators 1A, 3.3V; Manufacturer Part Number: AMS1117-3.3; Manufacturer: Advanced Monolithic Systems; Dropout Voltage: 1.1V; Output Type: Fixed; Nominal Supply Current: 5mA; Max Power Dissipation: 1.2W; Max Supply Voltage: 15V; Number Of Outputs: 1; Standoff Height: 0.64mm; Max Junction Temp: +125°C; Height: 1.8mm; Package: AMS1117; Device Class L2: Power Management ICs; ComponentLink2Description: Datasheet; ComponentLink2URL: http://www.advanced-monolithic.com/pdf/ds1117.pdf; Category: IC; RoHS: TRUE; Automotive: No; Device Class L1: Integrated Circuits (ICs); Output Current: 1A; Device Class L3: Voltage Regulators - Linear; Temperature: -40°C to +125°C; Output Voltage: 3.3V; Temperature Range Low: -40°C; Octopart: https://octopart.com/ams1117-3.3-advanced+monolithic+systems-25899300; Lead Free: Yes; Ipc Land Pattern Name: SOT229P700X180-4; Temperature Range High: +125°C
LED1 = CMP-44529-000064-1: LED YELLOW CLEAR CHIP SMD; Number of LEDs: 1; Luminous Intensity: 150mcd; Dominant Wavelength: 590nm; Test Current: 20mA; Illumination Color: Green; Forward Voltage: 2V; Viewing Angle: 110°; Number of Pins: 2; Packaging: Tape and Reel; Width: 1.25mm; Height: 0.4mm; Lens Color: Clear; RoHS Compliant: Yes; Lead Free: Lead Free; Min Operating Temperature: -40°C; Case Code (Imperial): 0805; Case/Package: 0805; Series: APHCM; Wavelength: 590nm; Max Operating Temperature: 85°C; Length: 2mm; Color: Yellow; Package Quantity: 2000; Mount: Surface Mount; Lens Style: Clear; Forward Current: 20mA; Case Code (Metric): 2012
LED2 Main_LED = CMP-44529-000064-1: LED YELLOW CLEAR CHIP SMD; Number of LEDs: 1; Luminous Intensity: 150mcd; Dominant Wavelength: 590nm; Test Current: 20mA; Forward Voltage: 2V; Viewing Angle: 110°; Number of Pins: 2; Packaging: Tape and Reel; Width: 1.25mm; Height: 0.4mm; Lens Color: Clear; RoHS Compliant: Yes; Illumination Color: Green; Lead Free: Lead Free; Min Operating Temperature: -40°C; Case Code (Imperial): 0805; Case/Package: 0805; Series: APHCM; Wavelength: 590nm; Max Operating Temperature: 85°C; Length: 2mm; Color: Yellow; Package Quantity: 2000; Mount: Surface Mount; Lens Style: Clear; Forward Current: 20mA; Case Code (Metric): 2012
R1-R23 R_IN = CMP-009-00076-2: 1K 0.125W 5% 0805 (2012 Metric)  SMD; Power: 125mW; Pins: 2; Mounting Technology: SMT; Tolerance: 5%; Case/Package: 0805
  R1 R_IN: Value: 10k
  R2: Value: 1K
  R3: Value: 27ohm
  R7 R22: Value: 1k
TP-5V TP-GND = CMP-15817-000011-1: PC TEST POINT NATURAL; Body Material: Brass; Plating: Tin; Material: Copper Alloy; Mount: Surface Mount; Color: Natural; Packaging: Tape and Reel; RoHS Compliant: Yes
USB_Port = CMP-2000-05408-1: Micro USB Receptacle Standard Type B Assy, 5-Pin SMD, RoHS, Tape and Reel; Manufacturer: TE Connectivity; Body Orientation: RightAngle; Number of Ports: 1Port; Number of Contacts: 5POS; Gender: RCP; Voltage Rating Max: 30VAC; Product Depth (mm): 5.6mm; Pitch (mm): 0.65mm; Current Rating (Max): 1/ContactA; Product Length (mm): 8mm; Product Height (mm): 3mm; Operating Temperature Max Deg. C: 85C; Datasheet URL: http://www.mouser.com/ds/2/418/NG_CD_1981568_E2-621296.pdf; Termination Method: Solder; Number of Terminals: 5; Operating Temp Range: -55Cto85C; Mounting Style: SurfaceMount; Manufacturer URL: http://www.te.com/; Contact Material: CopperAlloy; Packaging: TapeandReel; Datasheet Version: Rev. E2, 08/2015; Operating Temperature Min Deg. C: -55C; Housing Material: Thermoplastic; Type: MicroUSB; Contact Plating: GoldOverNickel
USB_To_Serial_UART = CMP-015-00000-2: USB UART IC, -0.5 to 6 V, 24 mA, -40 to 85 degC, 28-Pin SSOP, RoHS, Tape and Reel; Manufacturer: Future Technology Devices International (FTDI); Data Rate: 3Mbps; Channels: 1; Min Supply Voltage: 3.3V; Nominal Supply Voltage: 5V; Max Supply Voltage: 5.25V; Datasheet Version: Rev. 1.04, 02/2006; RoHS Compliant: True; Package Quantity: 2000; Manufacturer URL: http://www.ftdichip.com/; Interface: UART; Packaging: TapeandReel; Case/Package: SSOP; Datasheet URL: http://datasheet.octopart.com/FT232RL-FTDI-datasheet-120501.pdf; Min Operating Temperature: -40°C; Max Operating Temperature: 85°C; Pins: 16
XTAL1 = CMP-003-00000-2: Crystal, 16 MHz, +/-20 ppm, 18 pF, -20 to 70 degC, 2-Pin THD, RoHS; Manufacturer: Shenzhen Jingpengyuan; Frequency: 16MHz; Package Description: 2-Pin Through Hole Device, Body 11.05 x 4.65 mm, Pitch 4.88 mm; Mounting Technology: TH; Datasheet Version: Aug-14; Package Reference: 49S-18PF; RoHS Compliant: Unknown; Datasheet URL: http://datasheet.octopart.com/49S-18PF-Xinhunjing-datasheet-30677139.pdf; Case/Package: 49S-18PF; Manufacturer URL: http://www.chjiahui.com/